# EAGLE design HealthMonitor (EAGLE 9.5.0)
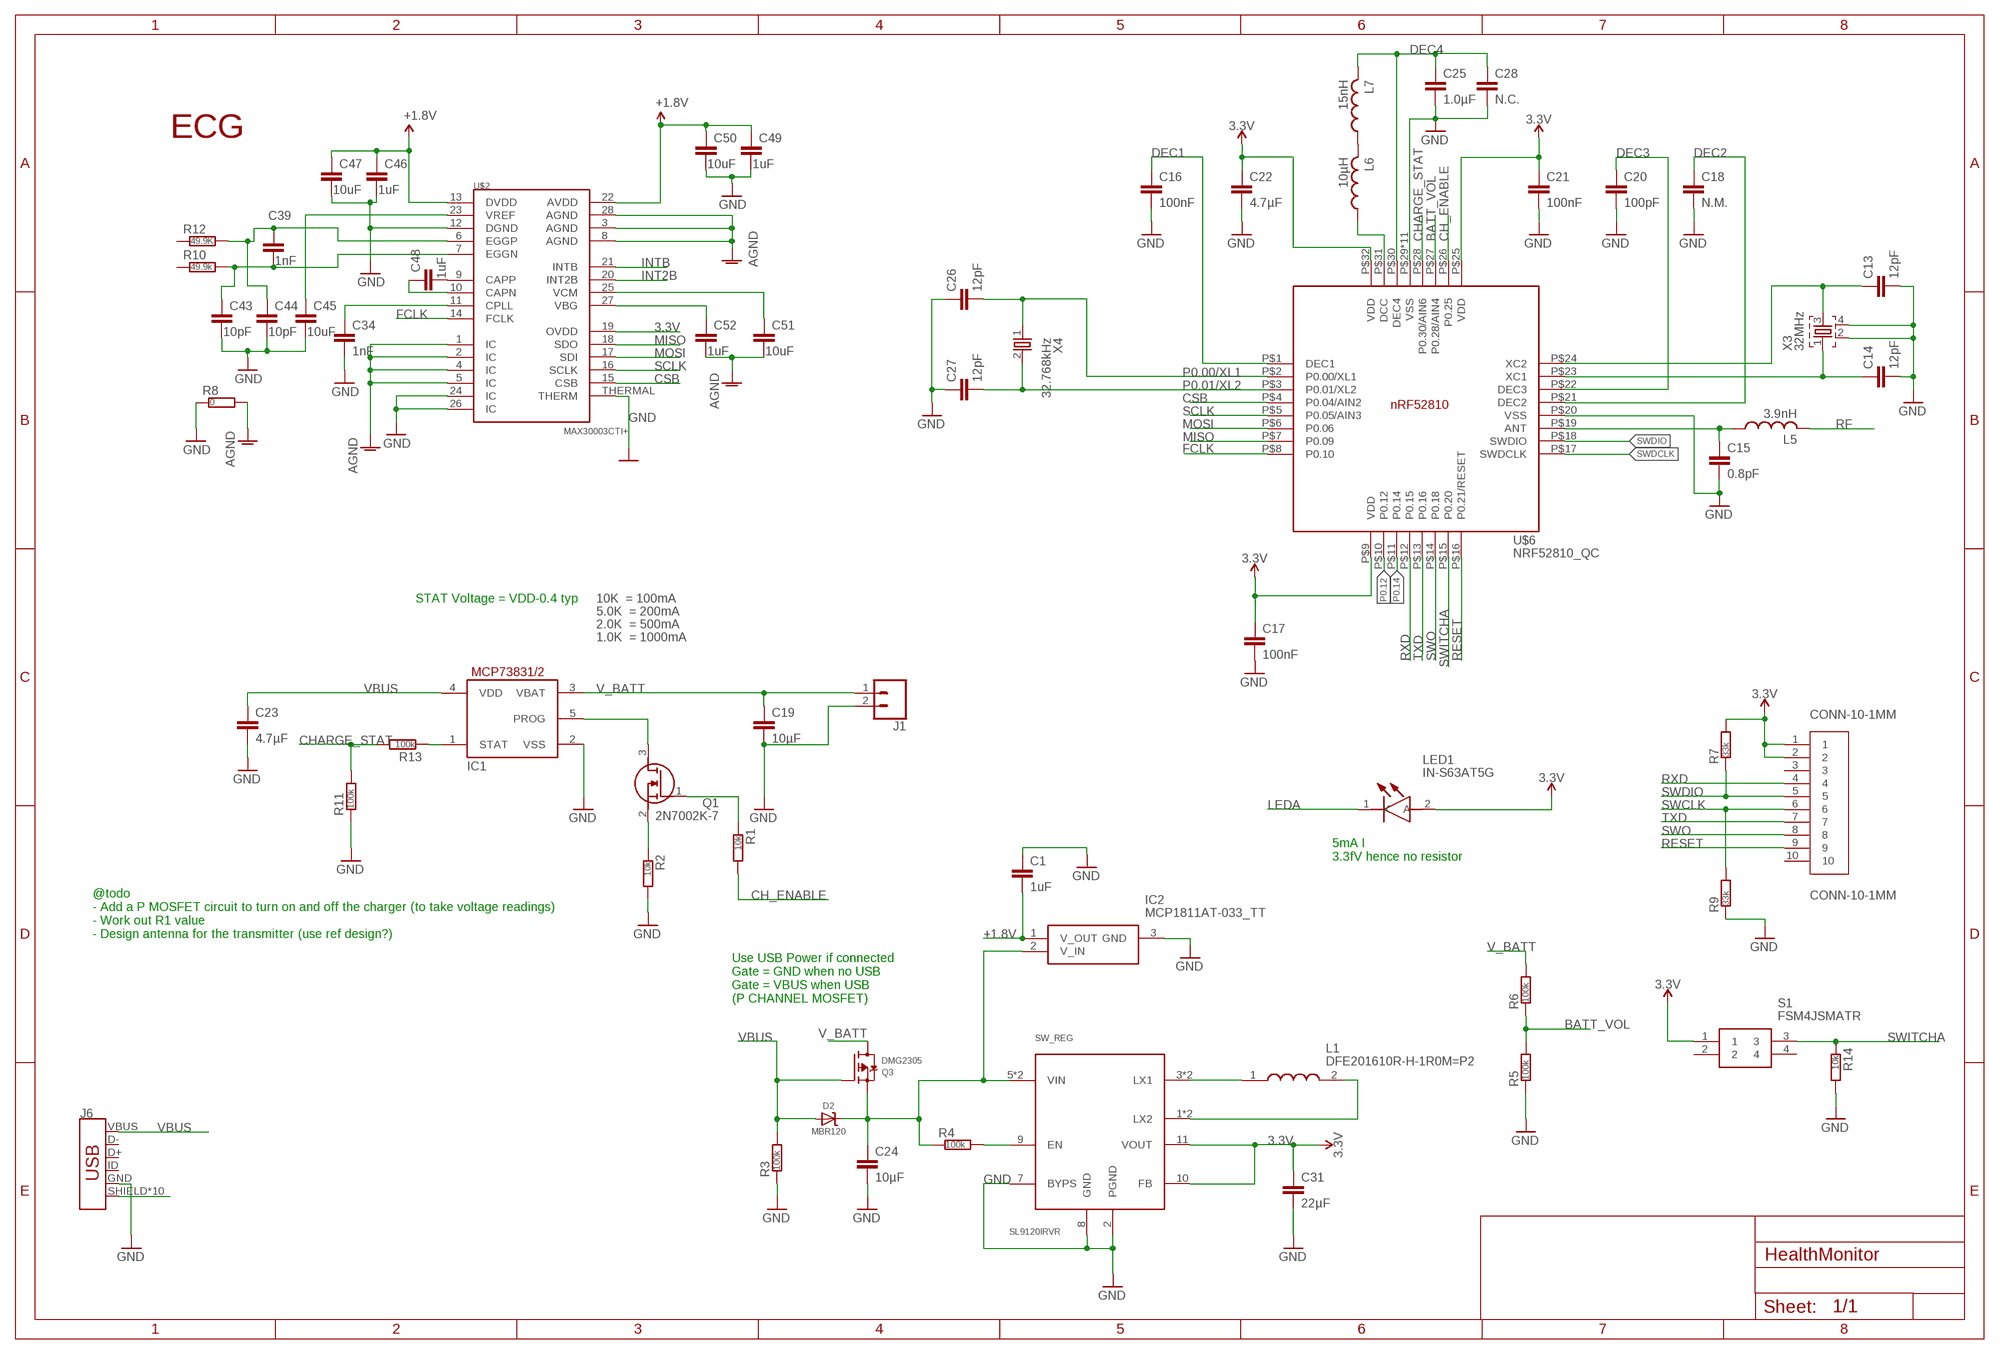
[diagram p0: schematic, sheet 1]

## Parts
C1  1uF  CAPACITOR_0402_N  [RESC0402_N]
C13  12pF  CAPACITOR_0402_N  [RESC0402_N]
C14  12pF  CAPACITOR_0402_N  [RESC0402_N]
C15  0.8pF  CAPACITOR_0402_N  [RESC0402_N]
C16  100nF  CAPACITOR_0402_N  [RESC0402_N]
C17  100nF  CAPACITOR_0402_N  [RESC0402_N]
C18  N.M.  CAPACITOR_0402_N  [RESC0402_N]
C19  10µF  CAPACITOR_0603_N  [RESC0603_N]
C20  100pF  CAPACITOR_0402_N  [RESC0402_N]
C21  100nF  CAPACITOR_0402_N  [RESC0402_N]
C22  4.7µF  CAPACITOR_0603_N  [RESC0603_N]
C23  4.7µF  CAPACITOR_0603_N  [RESC0603_N]
C24  10µF  CAPACITOR_0603_N  [RESC0603_N]
C25  1.0µF  CAPACITOR_0603_N  [RESC0603_N]
C26  12pF  CAPACITOR_0402_N  [RESC0402_N]
C27  12pF  CAPACITOR_0402_N  [RESC0402_N]
C28  N.C.  CAPACITOR_0402_N  [RESC0402_N]
C31  22µF  CAPACITOR_0603_N  [RESC0603_N]
C34  1nF  C-EUC0805  [C0805]
C39  1nF  CAPACITOR_0603_N  [RESC0603_N]
C43  10pF  CAPACITOR_0603_N  [RESC0603_N]
C44  10pF  CAPACITOR_0603_N  [RESC0603_N]
C45  10uF  CAPACITOR_0603_N  [RESC0603_N]
C46  1uF  CAPACITOR_0603_N  [RESC0603_N]
C47  10uF  CAPACITOR_0603_N  [RESC0603_N]
C48  1uF  CAPACITOR_0603_N  [RESC0603_N]
C49  1uF  CAPACITOR_0603_N  [RESC0603_N]
C50  10uF  CAPACITOR_0603_N  [RESC0603_N]
C51  10uF  CAPACITOR_0603_N  [RESC0603_N]
C52  1uF  CAPACITOR_0603_N  [RESC0603_N]
D2  MBR120  DIODE-SCHOTTKYSOD-123  [SOD-123]
IC1  MCP73831/OT  [SOT23-5L]
IC2  MCP1811AT-033_TT  [SOT95P237X112-3N]
J1  CONN_02  [1X02]
J6  USB_MICRO-B_HALF_PTH_MILL  [USB-MICROB-PTH-MILL]
L1  DFE201610R-H-1R0M=P2  [INDC2016X100N]
L5  3.9nH  INDUCTOR_0402_N  [RESC0402_N]
L6  10µH  INDUCTOR_0603_N  [RESC0603_N]
L7  15nH  INDUCTOR_0402_N  [RESC0402_N]
LED1  IN-S63AT5G  [LEDM168X39N]
Q1  2N7002K-7  [SOT96P240X100-3N]
Q3  DMG2305  MOSFET-P  [SOT23-R]
R1  10k  RESISTOR_0402_N  [RESC0402_N]
R2  10k  RESISTOR_0402_N  [RESC0402_N]
R3  100k  RESISTOR_0402_N  [RESC0402_N]
R4  100k  RESISTOR_0402_N  [RESC0402_N]
R5  100k  RESISTOR_0402_N  [RESC0402_N]
R6  100k  RESISTOR_0402_N  [RESC0402_N]
R7  33k  RESISTOR_0402_N  [RESC0402_N]
R8  0  RESISTOR_0402_N  [RESC0402_N]
R9  33k  RESISTOR_0402_N  [RESC0402_N]
R10  49.9k  RESISTOR_0402_N  [RESC0402_N]
R11  100k  RESISTOR_0402_N  [RESC0402_N]
R12  49.9K  RESISTOR_0402_N  [RESC0402_N]
R13  100k  RESISTOR_0402_N  [RESC0402_N]
R14  10k  RESISTOR_0402_N  [RESC0402_N]
S1  FSM4JSMATR  [FSM4JSMATR]
SW_REG  SL9120IRVR  [TQFN-12]
U$1  CONN-10-1MM  [CONN-10-1MM]
U$2  MAX30003CTI+  MAX30003  [QFN-28]
U$6  NRF52810_QC  [QFN50P500X500X90-32_N]
X3  32MHz  XTAL_32MHZ  [BT-XTAL_2016_N]
X4  32.768kHz  XTAL_32KHZ  [XTAL_3215_N]

## Nets
3.3V: C17.1 C21.1 C22.1 C31.1 LED1.2(A) R7.2 S1.1 SW_REG.10(FB) SW_REG.11(VOUT) U$1.1 U$1.2 U$2.19(OVDD) U$6.P$9(VDD) U$6.P$25(VDD) U$6.P$32(VDD)
+1.8V: C1.2 C46.1 C47.1 C49.1 C50.1 IC2.1(V_OUT) U$2.13(DVDD) U$2.22(AVDD)
AGND: C51.2 C52.2 R8.2 U$2.1(IC) U$2.2(IC) U$2.3(AGND) U$2.4(IC) U$2.5(IC) U$2.8(AGND) U$2.28(AGND)
ANT1: C15.1 L5.1 U$6.P$19(ANT)
BATT_VOL: R5.2 R6.1 U$6.P$27(P0.28/AIN4)
CH_ENABLE: R1.2 U$6.P$26(P0.25)
CHARGE_STAT: R11.2 R13.2 U$6.P$28(P0.30/AIN6)
CSB: U$2.15(CSB) U$6.P$4(P0.04/AIN2)
DEC1: C16.1 U$6.P$1(DEC1)
DEC2: C18.1 U$6.P$21(DEC2)
DEC3: C20.1 U$6.P$22(DEC3)
DEC4: C25.1 C28.1 L7.2 U$6.P$30(DEC4)
ECGN1: C39.2 C43.1 R10.2 U$2.7(EGGN)
ECGP1: C39.1 C44.1 R12.2 U$2.6(EGGP)
FCLK: U$2.14(FCLK) U$6.P$8(P0.10)
GND: C1.1 C13.2 C14.2 C15.2 C16.2 C17.2 C18.2 C19.2 C20.2 C21.2 C22.2 C23.2 C24.2 C25.2 C26.1 C27.1 C28.2 C31.2 C34.2 C43.2 C44.2 C45.2 C46.2 C47.2 C49.2 C50.2 IC1.2(VSS) IC2.3(GND) J1.2 J6.GND R2.2 R3.1 R5.1 R8.1 R9.1 R11.1 R14.2 SW_REG.2(PGND) SW_REG.7(BYPS) SW_REG.8(GND) U$2.12(DGND) U$2.24(IC) U$2.26(IC) U$2.THERMAL(THERM) U$6.P$20(VSS) U$6.P$29(VSS) U$6.P$33(VSS) U$6.P$34(VSS) U$6.P$35(VSS) U$6.P$36(VSS) U$6.P$37(VSS) U$6.P$38(VSS) U$6.P$39(VSS) U$6.P$40(VSS) U$6.P$41(VSS) U$6.P$42(VSS) X3.2 X3.4
INT2B: U$2.20(INT2B)
INTB: U$2.21(INTB)
LEDA: LED1.1(K)
MISO: U$2.18(SDO) U$6.P$7(P0.09)
MOSI: U$2.17(SDI) U$6.P$6(P0.06)
N$1: R4.2 SW_REG.9(EN)
N$2: IC1.1(STAT) R13.1
N$3: Q1.2(S) R2.1
N$4: Q1.1(G) R1.1
N$5: L1.1 SW_REG.3(LX1) SW_REG.4(LX1)
N$6: C24.1 D2.C IC2.2(V_IN) Q3.2(S) R4.1 SW_REG.5(VIN) SW_REG.6(VIN)
N$7: IC1.5(PROG) Q1.3(D)
N$8: L1.2 SW_REG.1(LX2) SW_REG.12(LX2)
N$9: C51.1 U$2.25(VCM)
N$13: C13.1 U$6.P$24(XC2) X3.3
N$14: L6.2 L7.1
N$15: L6.1 U$6.P$31(DCC)
N$17: C34.1 U$2.11(CPLL)
N$18: C48.1 U$2.10(CAPN)
N$19: C45.1 U$2.23(VREF)
N$20: C52.1 U$2.27(VBG)
N$23: C48.2 U$2.9(CAPP)
P0.00/XL1: C26.2 U$6.P$2(P0.00/XL1) X4.1
P0.01/XL2: C27.2 U$6.P$3(P0.01/XL2) X4.2
P0.12: U$6.P$10(P0.12)
P0.14: U$6.P$11(P0.14)
RESET: U$1.9 U$6.P$16(P0.21/RESET)
RF: L5.2
RXD: U$1.4 U$6.P$12(P0.15)
SCLK: U$2.16(SCLK) U$6.P$5(P0.05/AIN3)
SHIELD: J6.SHIELD J6.SHIELD2(SHIELD) J6.SHIELD3(SHIELD) J6.SHIELD4(SHIELD) J6.SHIELD5(SHIELD) J6.SHIELD6(SHIELD) J6.SHIELD7(SHIELD) J6.SHIELD8(SHIELD) J6.SHIELD9(SHIELD) J6.SHIELD10(SHIELD)
SWCLK: R9.2 U$1.6
SWDCLK: U$6.P$17(SWDCLK)
SWDIO: R7.1 U$1.5 U$6.P$18(SWDIO)
SWITCHA: R14.1 S1.3 U$6.P$15(P0.20)
SWO: U$1.8 U$6.P$14(P0.18)
TXD: U$1.7 U$6.P$13(P0.16)
V_BATT: C19.1 IC1.3(VBAT) J1.1 Q3.3(D) R6.2
VBUS [power]: C23.1 D2.A IC1.4(VDD) J6.VBUS Q3.1(G) R3.2
X2: C14.1 U$6.P$23(XC1) X3.1
Unconnected: J6.D+ J6.D- J6.ID R10.1 R12.1 S1.2 S1.4 U$1.3 U$1.10

## Notes on the sheet
- ECG
- STAT Voltage = VDD-0.4 typ | 10K  = 100mA
- 5.0K  = 200mA
- 2.0K  = 500mA
- 1.0K  = 1000mA
- 5mA I
  3.3fV hence no resistor
- @todo 
  - Add a P MOSFET circuit to turn on and off the charger (to take voltage readings) 
  - Work out R1 value 
  - Design antenna for the transmitter (use ref design?)
- Use USB Power if connected
  Gate = GND when no USB 
  Gate = VBUS when USB 
  (P CHANNEL MOSFET)

## Library data of the parts
C1 C13-C28 C31 C39 C43-C52 = Nordic_nRF:CAPACITOR: Generic chip capacitor
C34 = rcl:C-EU: CAPACITOR, European symbol
D2 = microbuilder:DIODE-SCHOTTKY
IC1 = adafruit:MCP73831: MCP73831/2 Miniature Single-Cell, Fully Integrated Li-Ion, Li-Polymer Charge Management Controllers. Nice and small simple lipoly charge controller, with adjustable current and status output (LED) http://www.ladyada.net/library/pcb/eaglelibrary.html
IC2 = SamacSys_Parts:MCP1811AT-033_TT: LDO Voltage Regulators Ultra Low Iq LDO Source: Datasheet <https://componentsearchengine.com/Datasheets/1/MCP1811AT-033_TT.pdf>; DESCRIPTION: LDO Voltage Regulators Ultra Low Iq LDO; HEIGHT: 1.12mm; MANUFACTURER_NAME: Microchip; MANUFACTURER_PART_NUMBER: MCP1811AT-033/TT; MOUSER_PART_NUMBER: 579-MCP1811AT-033/TT; MOUSER_PRICE-STOCK: https://www.mouser.com/Search/Refine.aspx?Keyword=579-MCP1811AT-033%2FTT
J1 = SparkFun-Connectors:CONN_02: Multi connection point. Often used as Generic Header-pin footprint for 0.1 inch spaced/style header connections On any of the 0.1 inch spaced packages, you can populate with these: Break Away Headers - Straight <https://www.sparkfun.com/products/116> (PRT-00116) Break Away Male Headers - Right Angle <https://www.sparkfun.com/products/553> (PRT-00553) Female Headers <https://www.sparkfun.com/products/115> (PRT-00115) Break Away Headers - Machine Pin <https://www.sparkfun.com/products/117> (PRT-00117) Break Away Female Headers - Swiss Machine Pin <https://www.sparkfun.com/products/743> (PRT-00743) For SCREWTERMINALS and SPRING TERMINALS visit here: Screw Terimnals on SparkFun.com <https://www.sparkfun.com/search/results?term=Screw+Terminals> (5mm/3.5mm/2.54mm spacing) This device is also useful as a general connection point to wire up your design to another part of your project. Our various solder wires solder well into these plated through hole pads. Hook-Up Wire - Assortment (Stranded, 22 AWG) <https://www.sparkfun.com/products/11375> (PRT-11375) Hook-Up Wire - Assortment (Solid Core, 22 AWG) <https://www.sparkfun.com/products/11367> (PRT-11367) View the entire wire category on our website here <https://www.sparkfun.com/categories/141> Special notes: Molex polarized connector foot print use with: PRT-08233 with associated crimp pins and housings. 2.54_SCREWTERM for use with PRT-10571. 3.5mm Screw Terminal footprints for PRT-08084 5mm Screw Terminal footprints for use with PRT-08432
J6 = SparkFun-Connectors:USB_MICRO-B: USB Type Micro-B Connector Male/female and PTH/SMT variants SparkFun Products: SparkFun microB USB Breakout <https://www.sparkfun.com/products/12035> SparkFun USB microB Plug Breakout <https://www.sparkfun.com/products/10031> SparkFun ESP8266 Thing <https://www.sparkfun.com/products/13231>; PROD_ID: CONN-13711
L1 = SamacSys_Parts:DFE201610R-H-1R0M=P2: DFE201610R Series Inductor 1.0uH +/-20% 0806 (2016) Source: Datasheet <https://psearch.en.murata.com/inductor/product/DFE201610R-H-1R0M#.html>; DESCRIPTION: DFE201610R Series Inductor 1.0uH +/-20% 0806 (2016); HEIGHT: 1mm; MANUFACTURER_NAME: Murata Electronics; MANUFACTURER_PART_NUMBER: DFE201610R-H-1R0M=P2; MOUSER_PART_NUMBER: 81-DFE201610RH1R0MP2; MOUSER_PRICE-STOCK: https://www.mouser.com/Search/Refine.aspx?Keyword=81-DFE201610RH1R0MP2
L5-L7 = Nordic_nRF:INDUCTOR: Generic chip inductor
LED1 = SamacSys_Parts:IN-S63AT5G: Standard LEDs - SMD True Green LED Source: Datasheet <http://www.inolux-corp.com/datasheet/SMDLED/Mono Color Top View/IN-S63AT Series_V1.1.pdf>; DESCRIPTION: Standard LEDs - SMD True Green LED; HEIGHT: 0.39mm; MANUFACTURER_NAME: Inolux; MANUFACTURER_PART_NUMBER: IN-S63AT5G; MOUSER_PART_NUMBER: 743-IN-S63AT5G; MOUSER_PRICE-STOCK: https://www.mouser.com/Search/Refine.aspx?Keyword=743-IN-S63AT5G
Q1 = SamacSys_Parts:2N7002K-7: N-CHANNEL ENHANCEMENT MODE MOSFET Source: Datasheet <https://www.diodes.com/assets/Datasheets/ds30896.pdf>; ALLIED_NUMBER: 70437208; ALLIED_PRICE-STOCK: https://www.alliedelec.com/diodes-inc-2n7002k-7/70437208/; DESCRIPTION: N-CHANNEL ENHANCEMENT MODE MOSFET; HEIGHT: 1mm; MANUFACTURER_NAME: Diodes Inc.; MANUFACTURER_PART_NUMBER: 2N7002K-7; MOUSER_PART_NUMBER: 621-2N7002K-7; MOUSER_PRICE-STOCK: https://www.mouser.com/Search/Refine.aspx?Keyword=621-2N7002K-7; RS_PART_NUMBER: 7703383; RS_PRICE-STOCK: https://uk.rs-online.com/web/p/products/7703383
Q3 = microbuilder:MOSFET-P: P-Channel Mosfet LEGEND VDS: Voltage Drain-Source ID: Drain Current RDS(ON): Drain-Source On-State Resistance VGS(TH): Gate-Source Threshold Voltage CISS: Drain-Source Input Capacitance SOT-23 Name VDS ID RDS(ON) VGS(TH) CISS Order Number IRLML5103 30V 760mA 600 mOhm -- 75pF @ 25V Digikey: IRLML5103PBFCT-ND IRLML6401 12V 4.3A 50 mOhm 950mV @ 250µA 830pF @ 10V Digikey: IRLML6401PBFTR-ND NTR0202PL 20V 400mA 800 mOhm 2.3V @ 250uA 70pF @ 5V Digikey: NTR0202PLT1GOSTR-ND NTR4101PT1G 20V 1.8A 85 mOhm 1.2V @ 250uA 675pF @ 10V Digikey: NTR4101PT1GOSCT-ND DMP2004K 20V 600mA 900 mOhm 1V @ 250uA 175pF @ 16V Digikey: DMP2004KDICT-ND PMV65XP 20V 3.9A 76 mOhm 950mV @ 1mA 725pF @ 20V Digikey: 568-2358-2-ND TO-252 Name VDS ID RDS(ON) VGS(TH) CISS Order Number AOD417 30V 25A 34 mOhm 3V @ 250µA 920pF @ 15V Digikey: 785-1106-2-ND PowerPak Name VDS ID RDS(ON) VGS(TH) CISS Order Number AON7401 30V 12A 14 mOhm 3V @ 250µA 2600pF @ 15V Digikey: 785-1302-1-ND
R1-R14 = Nordic_misc:RESISTOR: Generic chip resistor
S1 = SamacSys_Parts:FSM4JSMATR: Tactile switch,SMT,SPST,raised actuator Source: Datasheet <http://uk.rs-online.com/webdocs/0ee0/0900766b80ee0747.pdf>; ALLIED_NUMBER: 70156213; ALLIED_PRICE-STOCK: http://www.alliedelec.com/te-connectivity-fsm4jsmatr/70156213/; DESCRIPTION: Tactile switch,SMT,SPST,raised actuator; HEIGHT: mm; MANUFACTURER_NAME: TE Connectivity; MANUFACTURER_PART_NUMBER: FSM4JSMATR; MOUSER_PART_NUMBER: 506-FSM4JSMATR; MOUSER_PRICE-STOCK: https://www.mouser.com/Search/Refine.aspx?Keyword=506-FSM4JSMATR; RS_PART_NUMBER: 7182455P; RS_PRICE-STOCK: http://uk.rs-online.com/web/p/products/7182455P
SW_REG = MasumAhmed:SL9120IR
U$1 = MasumAhmed:CONN-10-1MM
U$2 = circuitects:MAX30003
U$6 = Nordic_nRF:NRF52810_QC: nRF52810 Features Single chip, highly flexible, 2.4 GHz multi-protocol SoC 32-bit ARM Cortex-M4 Processor 1.7v to 3.6v operation 192kB flash + 24kB RAM Supports concurrent Bluetooth low energy/ANT protocol operation Up to +4dBm output power -96dBm sensitivity, Bluetooth low energy Thread safe and run-time protected Event driven API On air compatible with nRF24L and nRF24AP series 2 data rates (2Mbps/1Mbps) PPI - maximum flexibility for power-efficient applications and code simplification Automated power management system with automatic power management of each peripheral Configurable I/O mapping for analog and digital I/O 1 x Master/Slave SPI 1 x Two-wire interface (I²C) UART (RTS/CTS) 1 x PWM (4 channels) AES HW encryption 8-channel 10/12-bit ADC Quadrature decoder 64-level analog comparator Real Time Counter (RTC) Digital microphone interface (PDM) On-chip balun Applications Bluetooth 5 connectivity processor Industrial sensors and actuators Wearables SmartHome sensors computer peripherals RF smart remotes Airfuel (A4WP) wireless charging Beacons Sports and fitness sensors Connected health products Smart watches RC Toys Interactive games Building automation
X3 = Nordic_nRF:XTAL_32MHZ
X4 = Nordic_nRF:XTAL_32KHZ

## Net classes
1 power: width 0.254 mm

## Board
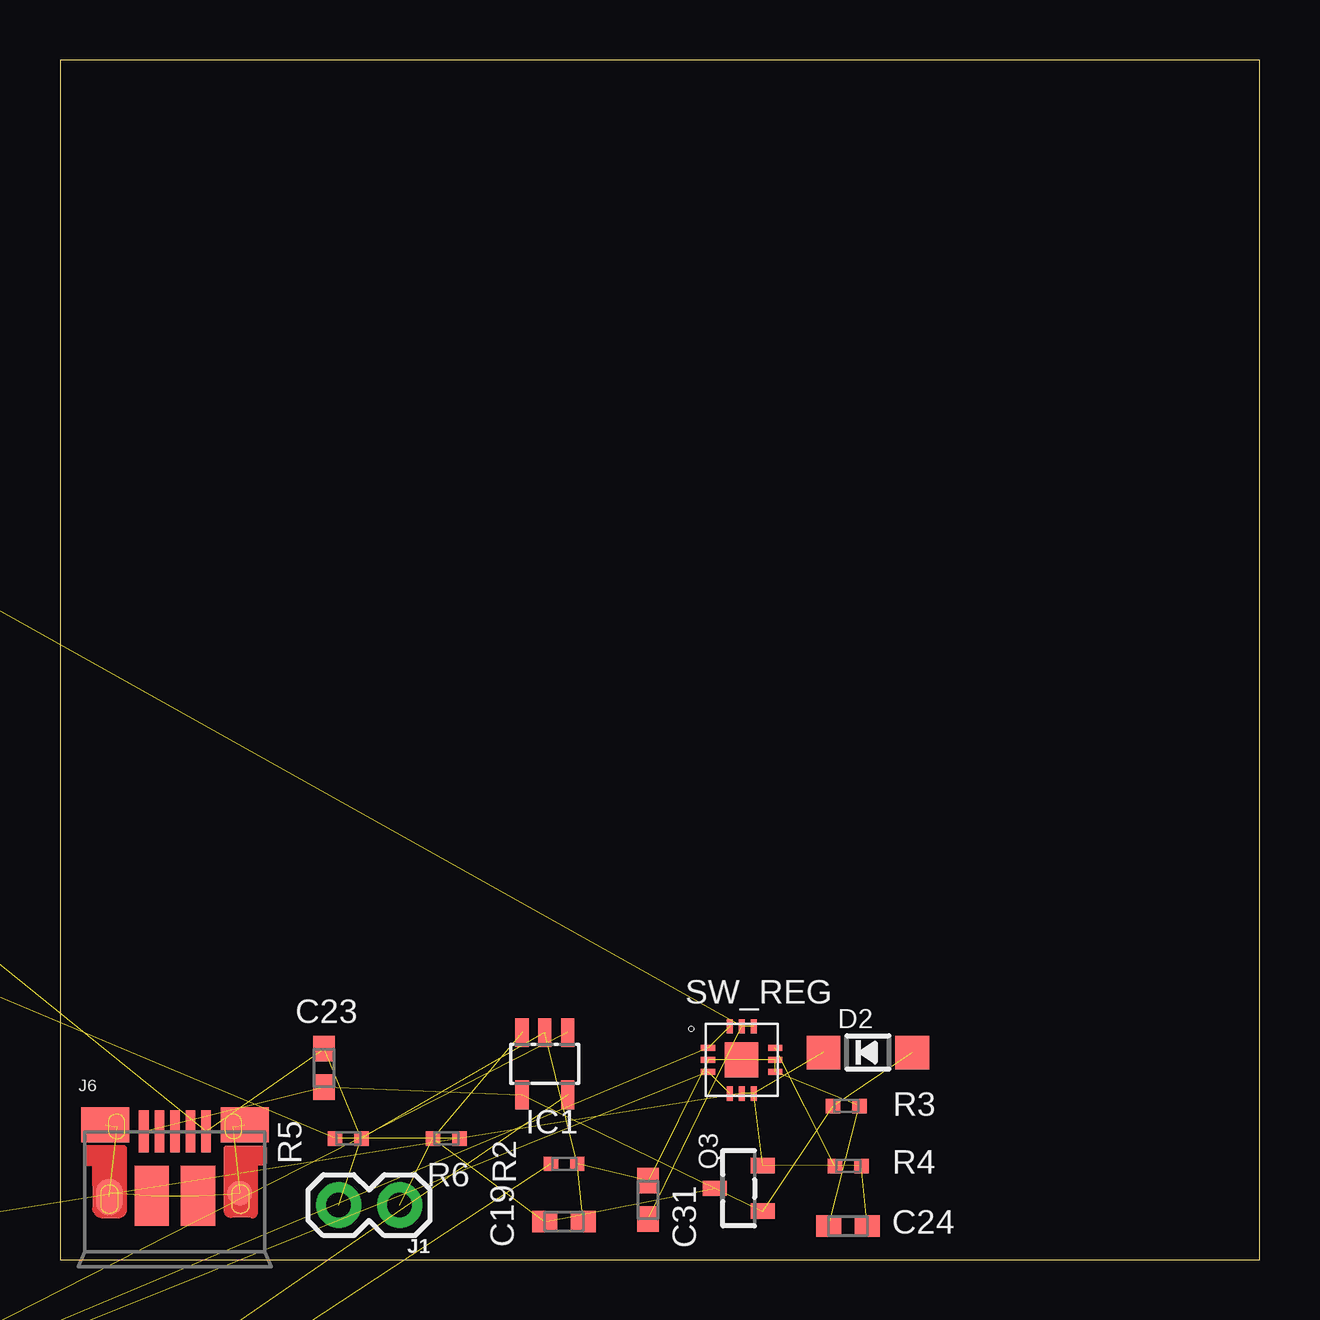
[diagram p1: board, top side]
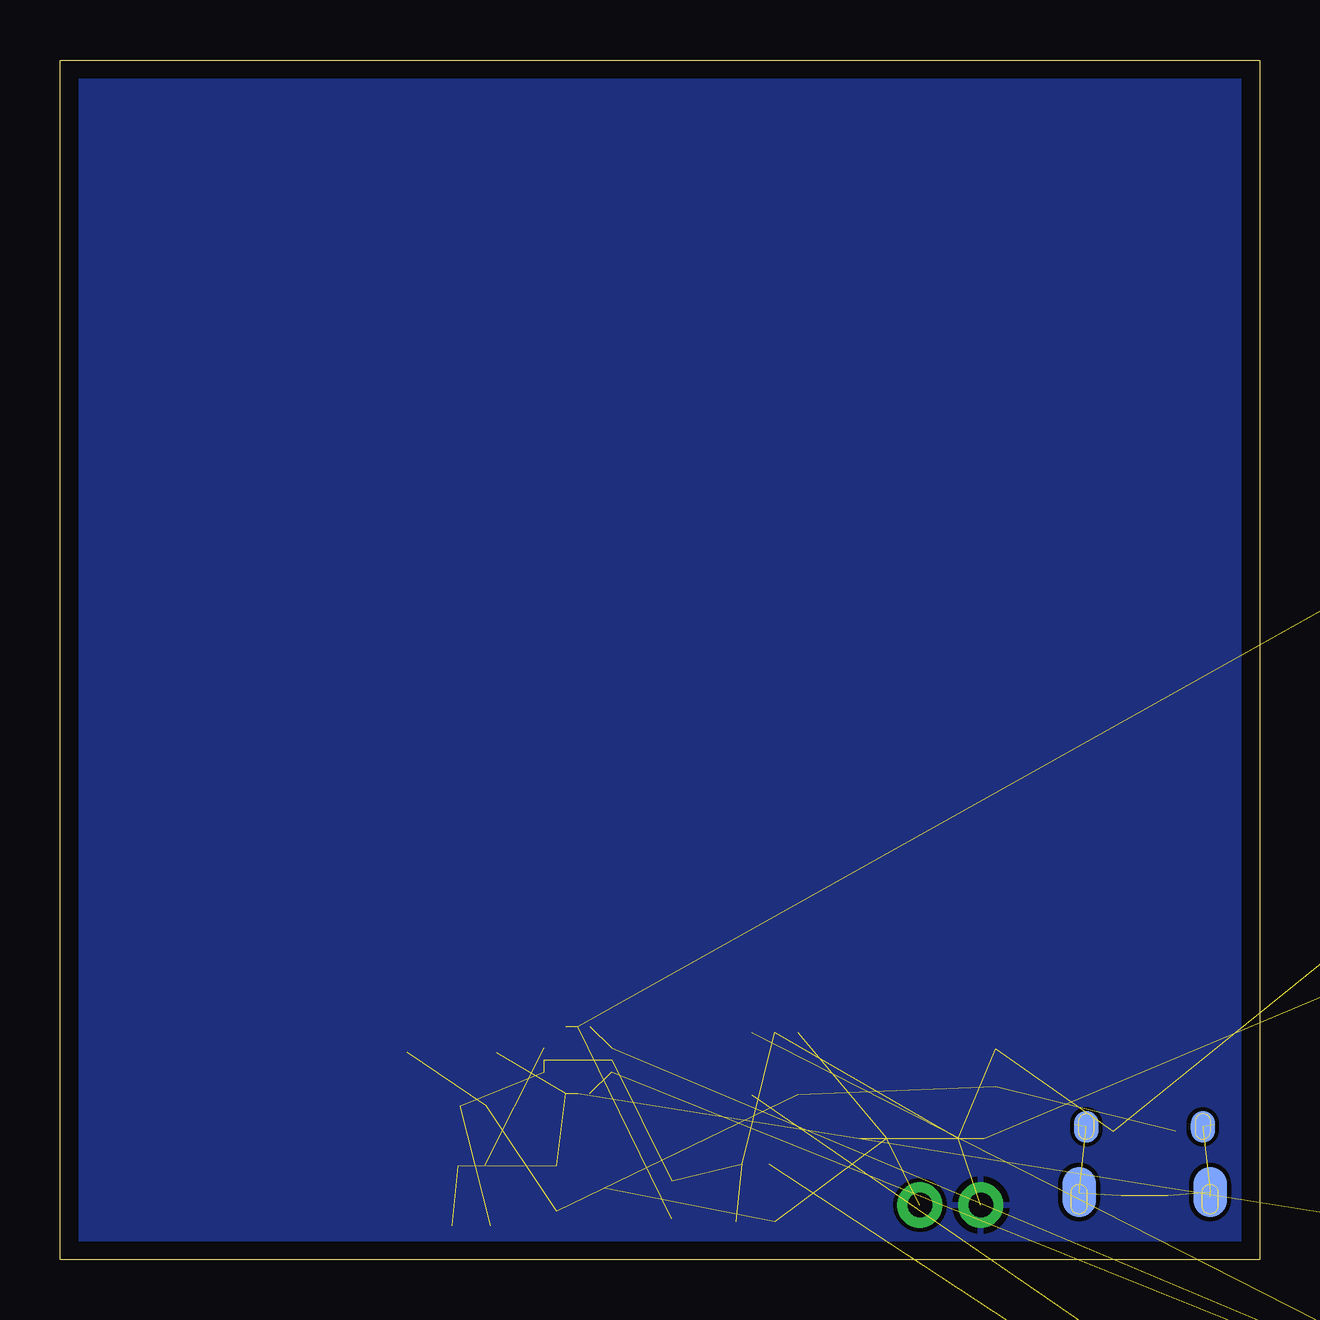
[diagram p2: board, bottom side, seen from below]

Size 49.98 x 50.01 mm. Coordinates in mm from the lower left corner, seen from the top.
Outline: 0,0 49.98,0 49.98,50.01 0,50.01 0,0
Copper layers (1*16): Top 0.035mm / dielectric 1.5mm / Bottom 0.035mm
Design rules "default *": minimum track width 8mil, minimum drill 0.35mm, track to track 7mil, track to pad 7mil, pad to pad 7mil, via to via 7mil, smd to smd 7mil, copper to edge 30mil, drill to drill 7mil, minimum pad ring 10mil, minimum via ring 8mil, stop-mask expansion 4mil, vias tented up to drill 0mil, thermal gap 10mil

### Footprints (pad centres in the part's own frame; a part is rotated, then mirrored left to right if it is on the bottom)
RESC0402_N = smd 0.6 x 0.6: 1 -0.55,0; 2 0.55,0
RESC0603_N = smd 1.05 x 0.9: 1 -0.8,0; 2 0.8,0
C0805 = smd 1.3 x 1.5: 1 -0.95,0; 2 0.95,0
SOD-123 = smd 1.4 x 1.4: A 1.85,0; C -1.85,0
SOT23-5L = smd 0.55 x 1.2: 1 -0.95,-1.3; 2 0,-1.3; 3 0.95,-1.3; 4 0.95,1.3; 5 -0.95,1.3
SOT95P237X112-3N = smd 1.25 x 0.65: 1 -1.05,0.95; 2 -1.05,-0.95; 3 1.05,0
1X02 = drill 1.016 pad 1.88: 1 0,0; 2 2.54,0
USB-MICROB-PTH-MILL = smd 0.4 x 1.75: D+ 0,0; D- -0.65,0; GND 1.3,0; ID 0.65,0; VBUS -1.3,0 | smd 2 x 1.46: SHIELD -2.9,0.275; SHIELD2 2.9,0.275 | smd 1.425 x 2.5: SHIELD3 -0.963,-2.675; SHIELD4 0.963,-2.675 | smd 1.4 x 2.1 bottom: SHIELD5 -2.731,-2.531; SHIELD7 2.729,-2.531 | smd 1 x 1: SHIELD6 2.7,-2.575 | smd 1.1 x 1.5: SHIELD8 -2.731,-2.731 | smd 1 x 1.3 bottom: SHIELD9 -2.43,0.195; SHIELD10 2.43,0.195
INDC2016X100N = smd 1.2 x 1.8: 1 -0.85,0; 2 0.85,0
LEDM168X39N = smd 1.1 x 0.75: 1 -0.85,0; 2 0.85,0
SOT96P240X100-3N = smd 1.1 x 0.65: 1 -1.05,0.96; 2 -1.05,-0.96; 3 1.05,0
SOT23-R = smd 0.635 x 1.016: 1 -0.95,-1; 2 0.95,-1; 3 0,1
FSM4JSMATR = smd 1.4 x 2.1: 1 2.25,4.55; 2 2.25,-4.55; 3 -2.25,4.55; 4 -2.25,-4.55
TQFN-12 = smd 0.6 x 0.25: 1 0,0; 2 0,-0.5; 3 0,-1; 7 2.8,-1; 8 2.8,-0.5; 9 2.8,0 | smd 0.25 x 0.6: 4 0.9,-1.9; 5 1.4,-1.9; 6 1.9,-1.9; 10 1.9,0.9; 11 1.4,0.9; 12 0.9,0.9 | smd 1.45 x 1.45: EPAD 1.4,-0.5
CONN-10-1MM = smd 0.61 x 2: 1 12.815,3; 2 11.815,3; 3 10.815,3; 4 9.815,3; 5 8.815,3; 6 7.815,3; 7 6.815,3; 8 5.815,3; 9 4.815,3; 10 3.815,3 | smd 2.68 x 3.6: P$1 0,0.2; P$12 16.63,0.2
QFN-28 = smd 1.15 x 0.27: 1 -2.4,1.5; 2 -2.4,1; 3 -2.4,0.5; 4 -2.4,0; 5 -2.4,-0.5; 6 -2.4,-1; 7 -2.4,-1.5; 15 2.4,-1.5; 16 2.4,-1; 17 2.4,-0.5; 18 2.4,0; 19 2.4,0.5; 20 2.4,1; 21 2.4,1.5 | smd 0.27 x 1.15: 8 -1.5,-2.4; 9 -1,-2.4; 10 -0.5,-2.4; 11 0,-2.4; 12 0.5,-2.4; 13 1,-2.4; 14 1.5,-2.4; 22 1.5,2.4; 23 1,2.4; 24 0.5,2.4; 25 0,2.4; 26 -0.5,2.4; 27 -1,2.4; 28 -1.5,2.4 | smd 3.15 x 3.15: THERMAL 0,0
QFN50P500X500X90-32_N = smd 0.85 x 0.3: P$1 -2.45,1.75; P$2 -2.45,1.25; P$3 -2.45,0.75; P$4 -2.45,0.25; P$5 -2.45,-0.25; P$6 -2.45,-0.75; P$7 -2.45,-1.25; P$8 -2.45,-1.75; P$17 2.45,-1.75; P$18 2.45,-1.25; P$19 2.45,-0.75; P$20 2.45,-0.25; P$21 2.45,0.25; P$22 2.45,0.75; P$23 2.45,1.25; P$24 2.45,1.75 | smd 0.3 x 0.85: P$9 -1.75,-2.45; P$10 -1.25,-2.45; P$11 -0.75,-2.45; P$12 -0.25,-2.45; P$13 0.25,-2.45; P$14 0.75,-2.45; P$15 1.25,-2.45; P$16 1.75,-2.45; P$25 1.75,2.45; P$26 1.25,2.45; P$27 0.75,2.45; P$28 0.25,2.45; P$29 -0.25,2.45; P$30 -0.75,2.45; P$31 -1.25,2.45; P$32 -1.75,2.45 | smd 3.65 x 3.65: P$33 0,0 | drill 0.3 pad 0.6: P$34 -1,1; P$35 0,1; P$36 1,1; P$37 -1,0; P$38 0,0; P$39 1,0; P$40 -1,-1; P$41 0,-1; P$42 1,-1
BT-XTAL_2016_N = smd 0.95 x 0.85: 1 -0.725,-0.575; 2 0.725,-0.575; 3 0.725,0.575; 4 -0.725,0.575
XTAL_3215_N = smd 1 x 1.8: 1 -1.25,0; 2 1.25,0

### Placement (x,y rotation side)
C1  -65,-24.5 0 top  (outside the outline)
C13  -60,6 0 top  (outside the outline)
C14  -54.5,6 0 top  (outside the outline)
C15  -47.5,11.5 0 top  (outside the outline)
C16  -54.5,17 0 top  (outside the outline)
C17  -48,17 0 top  (outside the outline)
C18  -60,0.5 0 top  (outside the outline)
C19  21,1.59 0 top
C20  -41.5,17 0 top  (outside the outline)
C21  -60,11.5 0 top  (outside the outline)
C22  -50,24 0 top  (outside the outline)
C23  11,8 90 top
C24  32.83,1.41 180 top
C25  -44,24 0 top  (outside the outline)
C26  -49,6 0 top  (outside the outline)
C27  -43.5,6 0 top  (outside the outline)
C28  -55,0.5 0 top  (outside the outline)
C31  24.5,2.5 90 top
C34  -18.5,38.5 0 top  (outside the outline)
C39  -10.5,24 0 top  (outside the outline)
C43  -21,30 0 top  (outside the outline)
C44  -15.5,30 0 top  (outside the outline)
C45  -10,30 0 top  (outside the outline)
C46  -27,18 0 top  (outside the outline)
C47  -27,24 0 top  (outside the outline)
C48  -22.5,18 0 top  (outside the outline)
C49  -18,18 0 top  (outside the outline)
C50  -21.5,24 0 top  (outside the outline)
C51  -16,24 0 top  (outside the outline)
C52  -13.5,18 0 top  (outside the outline)
D2  33.66,8.64 0 top
IC1  20.2,8.17 180 top
IC2  -57.5,-6 0 top  (outside the outline)
J1  14.15,2.28 180 top
J6  4.79,5.35 0 top
L1  -62.5,-28.5 0 top  (outside the outline)
L5  -53.5,11.5 0 top  (outside the outline)
L6  -60,17.5 0 top  (outside the outline)
L7  -41.5,11.5 0 top  (outside the outline)
LED1  -70,-78 0 top  (outside the outline)
Q1  -69,-54.5 0 top  (outside the outline)
Q3  28.28,2.98 90 top
R1  -73,-48 0 top  (outside the outline)
R2  21,4 0 top
R3  32.76,6.41 180 top
R4  32.84,3.91 180 top
R5  12.01,5.06 180 top
R6  16.09,5.06 180 top
R7  -60,55 0 top  (outside the outline)
R8  -9,18 0 top  (outside the outline)
R9  -60,49 0 top  (outside the outline)
R10  -27,30 0 top  (outside the outline)
R11  -72.5,-33 0 top  (outside the outline)
R12  -14,39 0 top  (outside the outline)
R13  -72.5,-38.5 0 top  (outside the outline)
R14  -73,-74 0 top  (outside the outline)
S1  -67.5,-65 0 top  (outside the outline)
SW_REG  27,8.83 0 top
U$1  -60,68 0 top  (outside the outline)
U$2  -24.5,37.5 0 top  (outside the outline)
U$6  -58,31.5 0 top  (outside the outline)
X3  -47.5,32.5 0 top  (outside the outline)
X4  -58,23.5 0 top  (outside the outline)

### Tracks (layer width: path | path; a pad name or v marks a point on that pad's centre or on a via)
3.3V  (14 unrouted)
+1.8V  (7 unrouted)
AGND  (9 unrouted)
ANT1  (2 unrouted)
BATT_VOL  (2 unrouted)
CH_ENABLE  (1 unrouted)
CHARGE_STAT  (2 unrouted)
CSB  (1 unrouted)
DEC1  (1 unrouted)
DEC2  (1 unrouted)
DEC3  (1 unrouted)
DEC4  (3 unrouted)
ECGN1  (3 unrouted)
ECGP1  (3 unrouted)
FCLK  (1 unrouted)
GND  (56 unrouted)
  pour Bottom: 0,50 0,0 50,0 50,50
MISO  (1 unrouted)
MOSI  (1 unrouted)
N$1  (1 unrouted)
N$2  (1 unrouted)
N$3  (1 unrouted)
N$4  (1 unrouted)
N$5  (2 unrouted)
N$6  (6 unrouted)
N$7  (1 unrouted)
N$8  (2 unrouted)
N$9  (1 unrouted)
N$13  (2 unrouted)
N$14  (1 unrouted)
N$15  (1 unrouted)
N$17  (1 unrouted)
N$18  (1 unrouted)
N$19  (1 unrouted)
N$20  (1 unrouted)
N$23  (1 unrouted)
P0.00/XL1  (2 unrouted)
P0.01/XL2  (2 unrouted)
RESET  (1 unrouted)
RXD  (1 unrouted)
SCLK  (1 unrouted)
SHIELD  (9 unrouted)
SWCLK  (1 unrouted)
SWDIO  (2 unrouted)
SWITCHA  (2 unrouted)
SWO  (1 unrouted)
TXD  (1 unrouted)
V_BATT  (4 unrouted)
VBUS  (5 unrouted)
X2  (2 unrouted)